# Altium schematic sheet [06] - AUDIO.SchDoc
size A3; DocumentNumber: 7; SheetNumber: 6; SheetTotal: 10
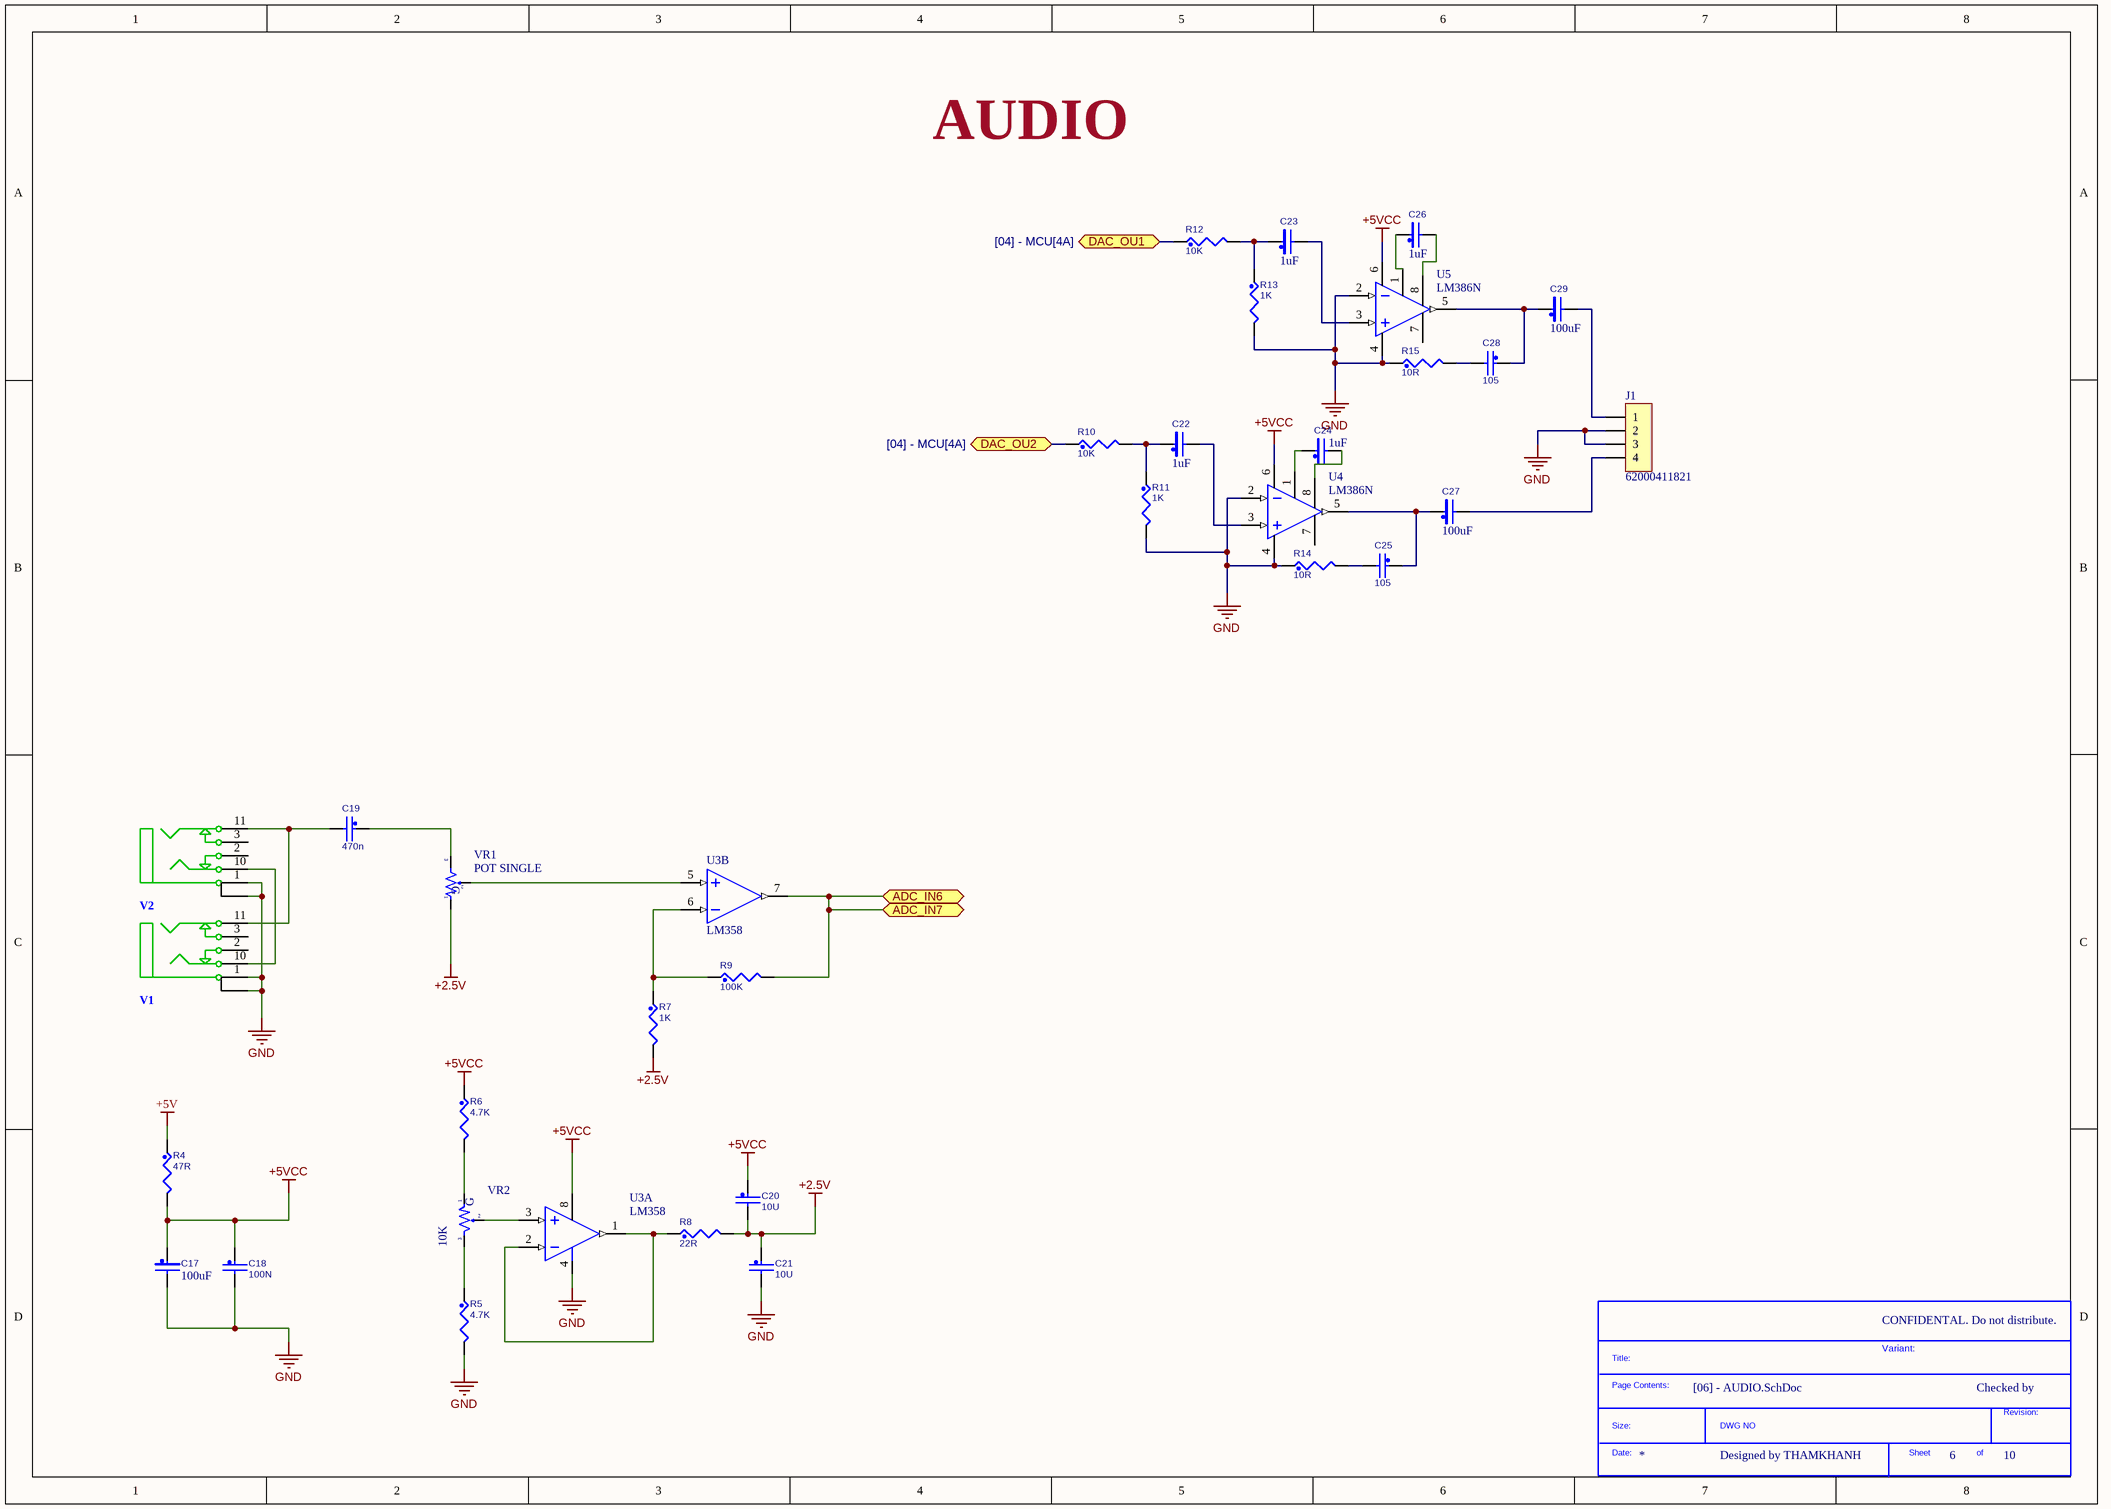
[diagram p0: [06] - AUDIO.SchDoc]

## Parts
*?  SDTitleBlock  (value not drawn)  (graphical)
C17  100uF  [CAP-TAN-SMD-3530]
C18  100N  [C0805]
C19  470n  [C0805]
C20  10U  [C0805]
C21  10U  [C0805]
C22  1uF  [CAP-TAN-SMD-3216]
C23  1uF  [CAP-TAN-SMD-3216]
C24  1uF  [CAP-TAN-SMD-3216]
C25  105  [C0805]
C26  1uF  [CAP-TAN-SMD-3216]
C27  100uF  [CAP-TAN-SMD-3530]
C28  105  [C0805]
C29  100uF  [CAP-TAN-SMD-3530]
J1  62000411821  [62000411121]
R4  47R  [R0805]
R5  4.7K  [R0805]
R6  4.7K  [R0805]
R7  1K  [R0805]
R8  22R  [R0805]
R9  100K  [R0805]
R10  10K  [R0603]
R11  1K  [R0603]
R12  10K  [R0603]
R13  1K  [R0603]
R14  10R  [R0805]
R15  10R  [R0805]
U3  LM358  [SOIC127P390X490-8N]  (parts A,B of 2)
U4  LM386N  [SOIC127P390X490-8N]
U5  LM386N  [SOIC127P390X490-8N]
V1  CON PhoneA  [PHONE3.50 2DFH]  (value not drawn)
V2  CON PhoneA  [PHONE3.50 2DFH]  (value not drawn)
VR1  POT SINGLE  [POTSD 2525V]
VR2  10K  [POTSD 3296V]

## Ports
ADC_IN6 (bidir), ADC_IN7 (bidir), DAC_OU1 (bidir, see [04] - MCU[4A]), DAC_OU2 (bidir, see [04] - MCU[4A])

## Nets
+2.5V: C20.2 C21.1 R7.2 R8.2 VR1.1
+5V: R4.1
+5VCC: C17.1 C18.1 C20.1 R4.2 R6.1 U3.8(+V) U4.6(+V) U5.6(+V)
GND: C17.2 C18.2 C21.2 J1.2 J1.3 R5.2 R11.2 R13.2 R14.1 R15.1 U3.4(-V) U4.2(IN-) U4.4(-V) U5.2(IN-) U5.4(-V) V1.1 V1.Shield V2.1 V2.Shield
ADC_IN6: R9.2 U3.7(OUT) ; port ADC_IN6, port ADC_IN7
DAC_OU1: R12.1 ; port DAC_OU1
DAC_OU2: R10.1 ; port DAC_OU2
NetC19_1: C19.1 VR1.3
NetC19_2: C19.2 V1.11 V2.11
NetC22_1: C22.1 R10.2 R11.1
NetC22_2: C22.2 U4.3(IN+)
NetC23_1: C23.1 R12.2 R13.1
NetC23_2: C23.2 U5.3(IN+)
NetC24_1: C24.1 U4.1(-V)
NetC24_2: C24.2 U4.8(-V)
NetC25_1: C25.1 C27.1 U4.5(OUT)
NetC25_2: C25.2 R14.2
NetC26_1: C26.1 U5.1(-V)
NetC26_2: C26.2 U5.8(-V)
NetC27_2: C27.2 J1.4
NetC28_1: C28.1 C29.1 U5.5(OUT)
NetC28_2: C28.2 R15.2
NetC29_2: C29.2 J1.1
NetR5_1: R5.1 VR2.3
NetR6_2: R6.2 VR2.1
NetR7_1: R7.1 R9.1 U3.6(IN-)
NetR8_1: R8.1 U3.1(OUT) U3.2(IN-)
NetU3_3: U3.3(IN+) VR2.2
NetU3_5: U3.5(IN+) VR1.2
NetV1_10: V1.10 V2.10

Not connected (* = marked no-connect by the designer): U4 7; U5 7; V1 2 3; V2 2 3

## Notes on the sheet
- AUDIO
- CONFIDENTAL. Do not distribute.
- Variant:
- Checked by
- Designed by THAMKHANH
- (in symbol POT SINGLE) G
- (in symbol SDTitleBlock) Title:; Page Contents:; Revision:; Size:; DWG NO; Date:; Sheet; of

## Library data of the parts
C17 C27 C29 = CAP-SMD-TANTALUM: Tantalum capacitor , T491A475K016AT, KEMET; Manufacturer Part Number: T491A105K016AT; Capacitance: 1uF; Tolerance: 20%; Voltage Rating: 16V; ESR (Equivalent Series Resistance): 10R; Leakage Current: 500nA; Polarity: Polar; Dissipation Factor: 4%; Life (Hours): 2000Hour; Ripple Current: 87mA; Manufacturer: KEMET; Mount: Surface Mount,PCB; Case/Package: 1206; Number of Pins: 2; Case Code (Imperial): 1206; Case Code (Metric): 3216; Dielectric Material: Tantalum; Min Operating Temperature: -55°C; Max Operating Temperature: 125°C; Packaging: Tape and Reel; Package Quantity: 1; Voltage Rating (DC): 16V; Termination: SMD/SMT; Voltage: 16V; Features: General Purpose; Length: 3.2mm; Height: 1.6mm; Width: 1.6mm; Height - Seated (Max): 0.071inch; Depth: 1.6mm; REACH SVHC: No SVHC; Lead Free: Lead Free; ComponentLink1URL: https://4donline.ihs.com/images/VipMasterIC/IC/KEME/KEME-S-A0006487387/KEME-S-A0006487387-1.pdf?hkey=52A5661711E402568146F3353EA87419&src-supplier=Element14; ComponentLink1Description: https://4donline.ihs.com/images/VipMasterIC/IC/KEME/KEME-S-A0006487387/KEME-S-A0006487387-1.pdf?hkey=52A5661711E402568146F3353EA87419&src-supplier=Element14; ComponentLink2URL: http://www.rapidonline.com/pdf/458280_da_en_01.pdf?src-supplier=Rapid+Electronics; ComponentLink2Description: http://www.rapidonline.com/pdf/458280_da_en_01.pdf?src-supplier=Rapid+Electronics; ComponentLink3URL: http://www.jameco.com/Jameco/Products/ProdDS/1573169.pdf?src-supplier=Jameco; ComponentLink3Description: http://www.jameco.com/Jameco/Products/ProdDS/1573169.pdf?src-supplier=Jameco; ComponentLink4URL: http://www.kemet.com/kemet/web/homepage/kechome.nsf/file/T491%20Series/$file/KEM_T2005_T491.pdf?src-supplier=Farnell; ComponentLink4Description: http://www.kemet.com/kemet/web/homepage/kechome.nsf/file/T491%20Series/$file/KEM_T2005_T491.pdf?src-supplier=Farnell; ComponentLink5URL: http://www.mouser.com/ds/2/212/KEM_T2005_T491-1093550.pdf?src-supplier=Mouser; ComponentLink5Description: http://www.mouser.com/ds/2/212/KEM_T2005_T491-1093550.pdf?src-supplier=Mouser; ComponentLink6URL: https://www.distrelec.biz/Web/Downloads/_t/ds/KEM_T2005_T491_eng_tds.pdf?mime=application%2Fpdf&src-supplier=Distrelec; ComponentLink6Description: https://www.distrelec.biz/Web/Downloads/_t/ds/KEM_T2005_T491_eng_tds.pdf?mime=application%2Fpdf&src-supplier=Distrelec; ComponentLink7URL: https://api.kemet.com/component-edge/download/datasheet/T491A105K016AT.pdf?src-supplier=Digi-Key; ComponentLink7Description: https://api.kemet.com/component-edge/download/datasheet/T491A105K016AT.pdf?src-supplier=Digi-Key; ComponentLink8URL: http://www.kemet.com/kemet/web/homepage/kechome.nsf/file/T491%20Series/$file/KEM_T2005_T491.pdf?src-supplier=Element14; ComponentLink8Description: http://www.kemet.com/kemet/web/homepage/kechome.nsf/file/T491%20Series/$file/KEM_T2005_T491.pdf?src-supplier=Element14; ComponentLink9URL: http://uk.rs-online.com/webdocs/1529/0900766b815290c9.pdf?src-supplier=RSComponents; ComponentLink9Description: http://uk.rs-online.com/webdocs/1529/0900766b815290c9.pdf?src-supplier=RSComponents; ComponentLink10URL: https://www.alliedelec.com/m/d/1172a60f7bb3eb66344f86e8fb9ddbde.pdf?src-supplier=Allied+Electronics; ComponentLink10Description: https://www.alliedelec.com/m/d/1172a60f7bb3eb66344f86e8fb9ddbde.pdf?src-supplier=Allied+Electronics; Radiation Hardening: No; ComponentLink11URL: https://api.kemet.com/component-edge/download/datasheet/T491A475K016AT.pdf?src-supplier=Digi-Key; ComponentLink11Description: https://api.kemet.com/component-edge/download/datasheet/T491A475K016AT.pdf?src-supplier=Digi-Key; ComponentLink12URL: http://www.jameco.com/Jameco/Products/ProdDS/1573425.pdf?src-supplier=Jameco; ComponentLink12Description: http://www.jameco.com/Jameco/Products/ProdDS/1573425.pdf?src-supplier=Jameco; ComponentLink13URL: http://uk.rs-online.com/webdocs/1515/0900766b81515525.pdf?src-supplier=RSComponents; ComponentLink13Description: http://uk.rs-online.com/webdocs/1515/0900766b81515525.pdf?src-supplier=RSComponents; ComponentLink14URL: http://www.farnell.com/datasheets/1854511.pdf?src-supplier=Element14; ComponentLink14Description: http://www.farnell.com/datasheets/1854511.pdf?src-supplier=Element14; ComponentLink15URL: http://www.rapidonline.com/pdf/458253_da_en_01.pdf?src-supplier=Rapid+Electronics; ComponentLink15Description: http://www.rapidonline.com/pdf/458253_da_en_01.pdf?src-supplier=Rapid+Electronics; ComponentLink16URL: https://produktinfo.conrad.com/datenblaetter/450000-474999/458253-da-01-en-TANTAL_KONDENSATOR_T491A475K016AT.pdf?src-supplier=Conrad; ComponentLink16Description: https://produktinfo.conrad.com/datenblaetter/450000-474999/458253-da-01-en-TANTAL_KONDENSATOR_T491A475K016AT.pdf?src-supplier=Conrad
C18-C21 C25 C28 = CAP-SMD-CERAMIC: Surface Mound Multilayer Ceramic Chip Capacitor (SMD MLCC); Manufacturer: TDK Corporation; Manufacturer Part Number: C2012X5R1C226K; Capacitance: 22pF; Voltage - Rated: 16V; Tolerance: ±10%; Temperature Coefficient: X5R; .Checked PCB: RF; RoHS: RoHS Compliant; Category: Capacitors; Mounting Type: Surface Mount, MLCC; Operating Temperature: -55°C ~ 85°C; Applications: General Purpose; Ratings: -; Package / Case: 0805 (2012 Metric); Size / Dimension: 0.079" L x 0.049" W (2.00mm x 1.25mm); Height - Seated (Max): -; Thickness (Max): 0.057" (1.45mm); Lead Spacing: -; Features: -; Packaging: Cut Tape (CT); Lead Style: -; ComponentLink1URL: http://www.tdk.com/pdf/general_B11.pdf; ComponentLink1Description: http://www.tdk.com/pdf/general_B11.pdf; .Checked SCH: RF
C22-C24 C26 = CAP-SMD-TANTALUM: Tantalum capacitor , T491A475K016AT, KEMET; Manufacturer Part Number: T491A105K016AT; Tolerance: 20%; Voltage Rating: 16V; ESR (Equivalent Series Resistance): 10R; Leakage Current: 500nA; Polarity: Polar; Dissipation Factor: 4%; Life (Hours): 2000Hour; Ripple Current: 87mA; Manufacturer: KEMET; Mount: Surface Mount,PCB; Case/Package: 1206; Number of Pins: 2; Case Code (Imperial): 1206; Case Code (Metric): 3216; Dielectric Material: Tantalum; Min Operating Temperature: -55°C; Max Operating Temperature: 125°C; Capacitance: 1uF; Packaging: Tape and Reel; Package Quantity: 1; Voltage Rating (DC): 16V; Termination: SMD/SMT; Voltage: 16V; Features: General Purpose; Length: 3.2mm; Height: 1.6mm; Width: 1.6mm; Height - Seated (Max): 0.071inch; Depth: 1.6mm; REACH SVHC: No SVHC; Lead Free: Lead Free; ComponentLink1URL: https://4donline.ihs.com/images/VipMasterIC/IC/KEME/KEME-S-A0006487387/KEME-S-A0006487387-1.pdf?hkey=52A5661711E402568146F3353EA87419&src-supplier=Element14; ComponentLink1Description: https://4donline.ihs.com/images/VipMasterIC/IC/KEME/KEME-S-A0006487387/KEME-S-A0006487387-1.pdf?hkey=52A5661711E402568146F3353EA87419&src-supplier=Element14; ComponentLink2URL: http://www.rapidonline.com/pdf/458280_da_en_01.pdf?src-supplier=Rapid+Electronics; ComponentLink2Description: http://www.rapidonline.com/pdf/458280_da_en_01.pdf?src-supplier=Rapid+Electronics; ComponentLink3URL: http://www.jameco.com/Jameco/Products/ProdDS/1573169.pdf?src-supplier=Jameco; ComponentLink3Description: http://www.jameco.com/Jameco/Products/ProdDS/1573169.pdf?src-supplier=Jameco; ComponentLink4URL: http://www.kemet.com/kemet/web/homepage/kechome.nsf/file/T491%20Series/$file/KEM_T2005_T491.pdf?src-supplier=Farnell; ComponentLink4Description: http://www.kemet.com/kemet/web/homepage/kechome.nsf/file/T491%20Series/$file/KEM_T2005_T491.pdf?src-supplier=Farnell; ComponentLink5URL: http://www.mouser.com/ds/2/212/KEM_T2005_T491-1093550.pdf?src-supplier=Mouser; ComponentLink5Description: http://www.mouser.com/ds/2/212/KEM_T2005_T491-1093550.pdf?src-supplier=Mouser; ComponentLink6URL: https://www.distrelec.biz/Web/Downloads/_t/ds/KEM_T2005_T491_eng_tds.pdf?mime=application%2Fpdf&src-supplier=Distrelec; ComponentLink6Description: https://www.distrelec.biz/Web/Downloads/_t/ds/KEM_T2005_T491_eng_tds.pdf?mime=application%2Fpdf&src-supplier=Distrelec; ComponentLink7URL: https://api.kemet.com/component-edge/download/datasheet/T491A105K016AT.pdf?src-supplier=Digi-Key; ComponentLink7Description: https://api.kemet.com/component-edge/download/datasheet/T491A105K016AT.pdf?src-supplier=Digi-Key; ComponentLink8URL: http://www.kemet.com/kemet/web/homepage/kechome.nsf/file/T491%20Series/$file/KEM_T2005_T491.pdf?src-supplier=Element14; ComponentLink8Description: http://www.kemet.com/kemet/web/homepage/kechome.nsf/file/T491%20Series/$file/KEM_T2005_T491.pdf?src-supplier=Element14; ComponentLink9URL: http://uk.rs-online.com/webdocs/1529/0900766b815290c9.pdf?src-supplier=RSComponents; ComponentLink9Description: http://uk.rs-online.com/webdocs/1529/0900766b815290c9.pdf?src-supplier=RSComponents; ComponentLink10URL: https://www.alliedelec.com/m/d/1172a60f7bb3eb66344f86e8fb9ddbde.pdf?src-supplier=Allied+Electronics; ComponentLink10Description: https://www.alliedelec.com/m/d/1172a60f7bb3eb66344f86e8fb9ddbde.pdf?src-supplier=Allied+Electronics; Radiation Hardening: No; ComponentLink11URL: https://api.kemet.com/component-edge/download/datasheet/T491A475K016AT.pdf?src-supplier=Digi-Key; ComponentLink11Description: https://api.kemet.com/component-edge/download/datasheet/T491A475K016AT.pdf?src-supplier=Digi-Key; ComponentLink12URL: http://www.jameco.com/Jameco/Products/ProdDS/1573425.pdf?src-supplier=Jameco; ComponentLink12Description: http://www.jameco.com/Jameco/Products/ProdDS/1573425.pdf?src-supplier=Jameco; ComponentLink13URL: http://uk.rs-online.com/webdocs/1515/0900766b81515525.pdf?src-supplier=RSComponents; ComponentLink13Description: http://uk.rs-online.com/webdocs/1515/0900766b81515525.pdf?src-supplier=RSComponents; ComponentLink14URL: http://www.farnell.com/datasheets/1854511.pdf?src-supplier=Element14; ComponentLink14Description: http://www.farnell.com/datasheets/1854511.pdf?src-supplier=Element14; ComponentLink15URL: http://www.rapidonline.com/pdf/458253_da_en_01.pdf?src-supplier=Rapid+Electronics; ComponentLink15Description: http://www.rapidonline.com/pdf/458253_da_en_01.pdf?src-supplier=Rapid+Electronics; ComponentLink16URL: https://produktinfo.conrad.com/datenblaetter/450000-474999/458253-da-01-en-TANTAL_KONDENSATOR_T491A475K016AT.pdf?src-supplier=Conrad; ComponentLink16Description: https://produktinfo.conrad.com/datenblaetter/450000-474999/458253-da-01-en-TANTAL_KONDENSATOR_T491A475K016AT.pdf?src-supplier=Conrad
J1 = JP4 2.00MM Single Socket: WR-PHD 2.00 mm Socket Header; Manufacturer: W¨¹rth Elektronik eiSos GmbH; ComponentLink1 Description: Manufacturer; ComponentLink2 Description: Datasheet; NoPins: 04; Created Date: 2 April 2013; partNo: 62000411821; ComponentLink1URL: http://www.we-online.com; ComponentLink2URL: http://katalog.we-online.de/em/datasheet/6200xx11821.pdf; Created by: Karrer Zheng
R4-R15 = RES-SMD: RES 0R OHM 1/8W 1% SMD; Manufacturer: Yageo; Manufacturer Part Number: RC0402FR-0749R9L; Power (Watts): 0.063W, 1/16W; .Checked PCB: used; Temperature Coefficient: ±100ppm/°C; Resistance: 3.3kR; Power Rating: 125mW; Voltage Rating: 100V; Category: Resistors; Supplier Part Number: 311-49.9LRCT-ND; Package / Case: 0402 (1005 Metric); Price 1k [$]: 0.01421; Tolerance: ±1%; Value: 0R; .Checked SCH: used; Supplier: Digikey; RoHS: RoHS Compliant; Composition: Thick Film; Features: -; Size / Dimension: 0.039" L x 0.020" W (1.00mm x 0.50mm); Height: 0.016" (0.40mm); Number of Terminations: 2; Packaging: Cut Tape (CT); ComponentLink1URL: http://www.yageo.com/documents/recent/PYu-RC0402_51_RoHS_L_6.pdf; ComponentLink1Description: http://www.yageo.com/documents/recent/PYu-RC0402_51_RoHS_L_6.pdf; Resistance (Ohms): 0R; Mount: Surface Mount; Case/Package: 0805; Number of Pins: 2; Contact Plating: Tin; Case Code (Metric): 2012; Case Code (Imperial): 0805; Min Operating Temperature: -55°C; Max Operating Temperature: 155°C; Package Quantity: 1; Termination: SMD/SMT; Military Standard: Not; Max Power Dissipation: 125mW; Voltage Rating (DC): 100V; Length: 2mm; Width: 1.25mm; Depth: 1.25mm; Radiation Hardening: No; REACH SVHC: No SVHC; Lead Free: Lead Free; ComponentLink2URL: http://www.farnell.com/datasheets/485442.pdf?src-supplier=Farnell; ComponentLink2Description: http://www.farnell.com/datasheets/485442.pdf?src-supplier=Farnell; ComponentLink3URL: http://uk.rs-online.com/webdocs/0bee/0900766b80beefcc.pdf?src-supplier=RSComponents; ComponentLink3Description: http://uk.rs-online.com/webdocs/0bee/0900766b80beefcc.pdf?src-supplier=RSComponents; ComponentLink4URL: http://industrial.panasonic.com/www-data/pdf/AOA0000/AOA0000CE26.pdf?src-supplier=Future+Electronics; ComponentLink4Description: http://industrial.panasonic.com/www-data/pdf/AOA0000/AOA0000CE26.pdf?src-supplier=Future+Electronics; ComponentLink5URL: https://www.alliedelec.com/m/d/b6b0537e86f421aa7f5975bb1d8f429a.pdf?src-supplier=Allied+Electronics; ComponentLink5Description: https://www.alliedelec.com/m/d/b6b0537e86f421aa7f5975bb1d8f429a.pdf?src-supplier=Allied+Electronics; ComponentLink6URL: http://industrial.panasonic.com/www-data/pdf/AOA0000/AOA0000CE26.pdf?src-supplier=Avnet; ComponentLink6Description: http://industrial.panasonic.com/www-data/pdf/AOA0000/AOA0000CE26.pdf?src-supplier=Avnet; ComponentLink7URL: http://industrial.panasonic.com/www-data/pdf/AOA0000/AOA0000CE26.pdf?src-supplier=Avnet+Europe; ComponentLink7Description: http://industrial.panasonic.com/www-data/pdf/AOA0000/AOA0000CE26.pdf?src-supplier=Avnet+Europe; ComponentLink8URL: http://industrial.panasonic.com/cdbs/www-data/pdf/RDM0000/AOA0000C307.pdf?src-supplier=Farnell; ComponentLink8Description: http://industrial.panasonic.com/cdbs/www-data/pdf/RDM0000/AOA0000C307.pdf?src-supplier=Farnell; ComponentLink9URL: https://www.distrelec.biz/Web/Downloads/_t/ds/ERA_eng_tds.pdf?mime=application%2Fpdf&src-supplier=Distrelec; ComponentLink9Description: https://www.distrelec.biz/Web/Downloads/_t/ds/ERA_eng_tds.pdf?mime=application%2Fpdf&src-supplier=Distrelec; ComponentLink10URL: http://www.farnell.com/datasheets/485442.pdf?src-supplier=Element14; ComponentLink10Description: http://www.farnell.com/datasheets/485442.pdf?src-supplier=Element14; ComponentLink11URL: http://www.farnell.com/datasheets/2052875.pdf?src-supplier=Farnell; ComponentLink11Description: http://www.farnell.com/datasheets/2052875.pdf?src-supplier=Farnell; ComponentLink12URL: http://www.farnell.com/datasheets/2059650.pdf?src-supplier=Farnell; ComponentLink12Description: http://www.farnell.com/datasheets/2059650.pdf?src-supplier=Farnell; ComponentLink13URL: https://produktinfo.conrad.com/datenblaetter/450000-474999/453184-da-01-en-WIDERSTAND_0805_ERA.pdf?src-supplier=Conrad; ComponentLink13Description: https://produktinfo.conrad.com/datenblaetter/450000-474999/453184-da-01-en-WIDERSTAND_0805_ERA.pdf?src-supplier=Conrad
U3 = LM358: Low-Power Dual Operational Amplifier
U4 U5 = LM386N: TEXAS INSTRUMENTS         LM386N-3/NOPB            AUDIO POWER AMPLIFIER, CLASS AB, 700mW DIP-8
V1 V2 = CON PhoneA: Connector, 3.5mm Stereo Audio Socket, Black, 2 break contacts (normals) and 2 auxiliary make contacts
VR1 VR2 = POT SINGLE: Var Resistor